# Altium schematic sheet PCB_DYBoard_Bandmaster_V2_SCH4.SchDoc
size A4; SheetNumber: 4; SheetTotal: 4
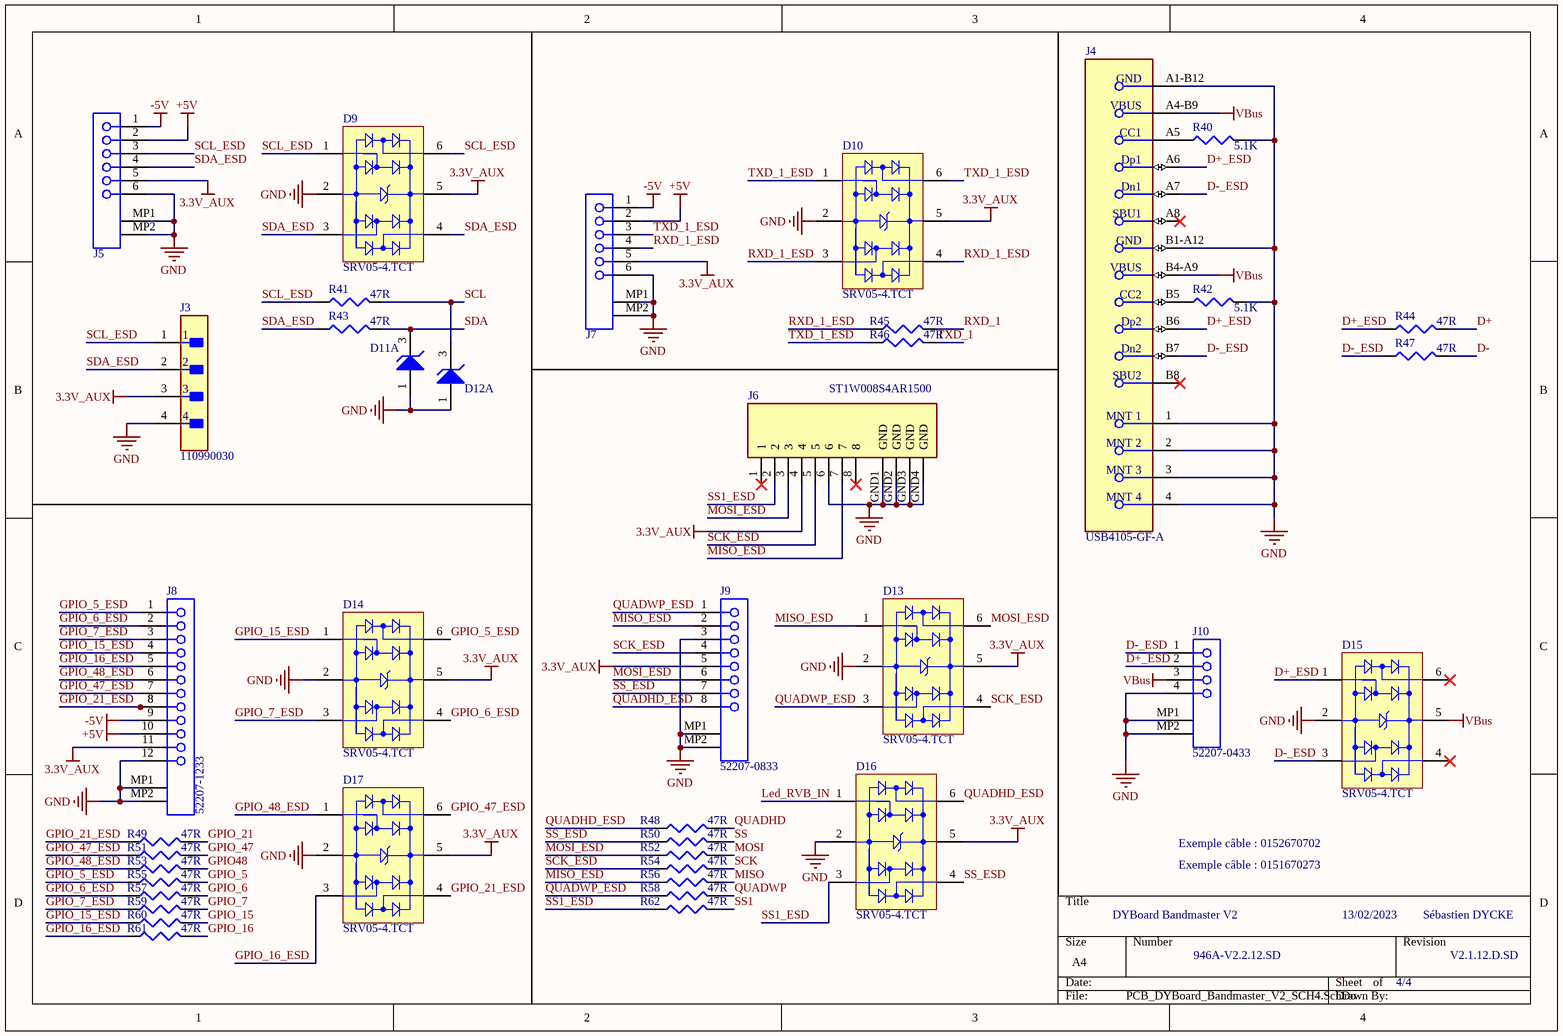
[diagram p0: PCB_DYBoard_Bandmaster_V2_SCH4.SchDoc]

## Parts
D9  SRV05-4.TCT  [SMTC-SOT23-6_V]
D10  SRV05-4.TCT  [SMTC-SOT23-6_V]
D11  BZX84C3V9LT1G  [ONSC-SOT-23-3-318-08_V]  (value not drawn)  (part A of 2)
D12  BZX84C3V9LT1G  [ONSC-SOT-23-3-318-08_V]  (value not drawn)  (part A of 2)
D13  SRV05-4.TCT  [SMTC-SOT23-6_V]
D14  SRV05-4.TCT  [SMTC-SOT23-6_V]
D15  SRV05-4.TCT  [SMTC-SOT23-6_V]
D16  SRV05-4.TCT  [SMTC-SOT23-6_V]
D17  SRV05-4.TCT  [SMTC-SOT23-6_V]
J3  110990030  [FP-110990030-MFG]
J4  USB4105-GF-A  [FP-USB4105-GF-A-MFG]
J5  SEB_MOLeX_6p  [SEB_MOLeX_6p]  (value not drawn)
J6  ST1W008S4AR1500  [JAE_ST1W008S4AR1500]
J7  SEB_MOLeX_6p  [SEB_MOLeX_6p]  (value not drawn)
J8  52207-1233  [52207-1233]
J9  52207-0833  [con_molex_8_52207-0833]
J10  52207-0433  [52207-0433]
R40  value 5.1K  [J1-0603]  (hidden comment: Res3)
R41  value 47R  [J1-0603]  (hidden comment: Res3)
R42  value 5.1K  [J1-0603]  (hidden comment: Res3)
R43  value 47R  [J1-0603]  (hidden comment: Res3)
R44  value 47R  [J1-0603]  (hidden comment: Res3)
R45  value 47R  [J1-0603]  (hidden comment: Res3)
R46  value 47R  [J1-0603]  (hidden comment: Res3)
R47  value 47R  [J1-0603]  (hidden comment: Res3)
R48  value 47R  [J1-0603]  (hidden comment: Res3)
R49  value 47R  [J1-0603]  (hidden comment: Res3)
R50  value 47R  [J1-0603]  (hidden comment: Res3)
R51  value 47R  [J1-0603]  (hidden comment: Res3)
R52  value 47R  [J1-0603]  (hidden comment: Res3)
R53  value 47R  [J1-0603]  (hidden comment: Res3)
R54  value 47R  [J1-0603]  (hidden comment: Res3)
R55  value 47R  [J1-0603]  (hidden comment: Res3)
R56  value 47R  [J1-0603]  (hidden comment: Res3)
R57  value 47R  [J1-0603]  (hidden comment: Res3)
R58  value 47R  [J1-0603]  (hidden comment: Res3)
R59  value 47R  [J1-0603]  (hidden comment: Res3)
R60  value 47R  [J1-0603]  (hidden comment: Res3)
R61  value 47R  [J1-0603]  (hidden comment: Res3)
R62  value 47R  [J1-0603]  (hidden comment: Res3)

## Nets
3.3V_AUX: D9.5(VBUS) D10.5(VBUS) D13.5(VBUS) D14.5(VBUS) D16.5(VBUS) D17.5(VBUS) J3.3 J5.5 J6.4 J7.5 J8.11 J9.5
+5V: J5.2 J7.2 J8.10
-5V: J5.1 J7.1 J8.9
GND: D9.2(GND) D10.2(GND) D11.1(A) D12.1(A) D13.2(GND) D14.2(GND) D15.2(GND) D16.2(GND) D17.2(GND) J3.4 J4.1(MNT_1) J4.2(MNT_2) J4.3(MNT_3) J4.4(MNT_4) J4.A1-B12(GND) J4.B1-A12(GND) J5.6 J5.MP1 J5.MP2 J6.6 J6.GND1(GND) J6.GND2(GND) J6.GND3(GND) J6.GND4(GND) J7.6 J7.MP1 J7.MP2 J8.12 J8.MP1 J8.MP2 J9.3 J9.MP1 J9.MP2 J10.4 J10.MP1 J10.MP2 R40.2 R42.2
VBus: D15.5(VBUS) J4.A4-B9(VBUS) J4.B4-A9(VBUS) J10.3
D+: R44.2
D+_ESD: D15.1(I/O_1) J4.A6(Dp1) J4.B6(Dp2) J10.2 R44.1
D-: R47.2
D-_ESD: D15.3(I/O_2) J4.A7(Dn1) J4.B7(Dn2) J10.1 R47.1
GPIO48: R53.2
GPIO_5: R55.2
GPIO_5_ESD: D14.6(I/O_4) J8.1 R55.1
GPIO_6: R57.2
GPIO_6_ESD: D14.4(I/O_3) J8.2 R57.1
GPIO_7: R59.2
GPIO_7_ESD: D14.3(I/O_2) J8.3 R59.1
GPIO_15: R60.2
GPIO_15_ESD: D14.1(I/O_1) J8.4 R60.1
GPIO_16: R61.2
GPIO_16_ESD: D17.3(I/O_2) J8.5 R61.1
GPIO_21: R49.2
GPIO_21_ESD: D17.4(I/O_3) J8.8 R49.1
GPIO_47: R51.2
GPIO_47_ESD: D17.6(I/O_4) J8.7 R51.1
GPIO_48_ESD: D17.1(I/O_1) J8.6 R53.1
Led_RVB_IN: D16.1(I/O_1)
MISO: R56.2
MISO_ESD: D13.1(I/O_1) J6.7 J9.2 R56.1
MOSI: R52.2
MOSI_ESD: D13.6(I/O_4) J6.3 J9.6 R52.1
QUADHD: R48.2
QUADHD_ESD: D16.6(I/O_4) J9.8 R48.1
QUADWP: R58.2
QUADWP_ESD: D13.3(I/O_2) J9.1 R58.1
RXD_1: R45.2
RXD_1_ESD: D10.3(I/O_2) D10.4(I/O_3) J7.4 R45.1
SCK: R54.2
SCK_ESD: D13.4(I/O_3) J6.5 J9.4 R54.1
SCL: D12.3(K) R41.2
SCL_ESD: D9.1(I/O_1) D9.6(I/O_4) J3.1 J5.3 R41.1
SDA: D11.3(K) R43.2
SDA_ESD: D9.3(I/O_2) D9.4(I/O_3) J3.2 J5.4 R43.1
SS: R50.2
SS1: R62.2
SS1_ESD: D16.3(I/O_2) J6.2 R62.1
SS_ESD: D16.4(I/O_3) J9.7 R50.1
TXD_1: R46.2
TXD_1_ESD: D10.1(I/O_1) D10.6(I/O_4) J7.3 R46.1
NetJ4_A5: J4.A5(CC1) R40.1
NetJ4_B5: J4.B5(CC2) R42.1

Not connected (* = marked no-connect by the designer): D15 4(I/O_3)* 6(I/O_4)*; J4 A8(SBU1)* B8(SBU2)*; J6 1* 8*

## Notes on the sheet
- Exemple câble : 0152670702
- DYBoard Bandmaster V2
- Exemple câble : 0151670273
- 13/02/2023
- Sébastien DYCKE
- 946A-V2.2.12.SD
- 4/4
- V2.1.12.D.SD

## Library data of the parts
D9 D10 D13-D17 = CMP-2000-05358-1: RailClamp(R) Low Capacitance TVS Diode Array, 5 pF, 17.5 VC, -55 to 125 degC, 6-Pin SOT23, RoHS, Tape and Reel; Manufacturer: Semtech; Leakage Current (Max): 5uA; Polarity: Uni-Directional; Peak Pulse Power Dissipation: 300W; Clamping Voltage: 17.5V; Number of Elements: 1; Working Voltage: 5V; Test Current (It): 1mA; Configuration: Quad; Reverse Breakdown Voltage: 6V; Suppressor Type: DiodeArrays; Peak Pulse Current: 12A; Product Depth (mm): 1.6mm; Product Height (mm): 1.15mm; Clamping Voltage (Max): 12.5V; Rad Hardened: No; Product Length (mm): 2.9mm; Capacitance Value: 5pF; Mounting: SurfaceMount; Datasheet URL: https://datasheet.ciiva.com/8029/srv05-4-8029973.pdf; Datasheet Version: Jan-08; Packaging: TapeandReel; Package / Case: SOT-23; Operating Temp Range: -55Cto125C; Pin Count: 6; Direction Type: Uni-Directional; Operating Temperature Min Deg. C: -55C; Reverse Stand-off Voltage: 5V; Leakage Current: 5uA; Manufacturer URL: http://www.semtech.com/; Working Voltage (Max): 5V; Package Reference: SOT23-6; Package Description: 6-Pin Small Outline Transistor, Body 2.9 x 1.6 mm, Pitch 0.95 mm; Operating Temperature Max Deg. C: 125C; Operating Temperature Classification: Military; Mounting Style: SurfaceMount
D11 D12 = CMP-1060-01129-1: Zener Voltage Regulator, 225 mW, 3-Pin SOT-23, Pb-Free, Tape and Reel; Manufacturer: On Semiconductor; ComponentLink3URL: http://www.onsemi.cn/pub_link/Collateral/318-08.PDF; PartNumber: BZX84C3V9LT1G; ComponentLink2URL: http://www.onsemi.com/pub_link/Collateral/BZX84C2V4LT1-D.PDF; PackageReference: SOT-23-3-318-08; DatasheetVersion: Rev. 17; ComponentLink3Description: Package Specification; ComponentLink1Description: Manufacturer URL; Packing: Tape and Reel; ComponentLink1URL: http://www.onsemi.com/; RoHS: Pb-Free; PackageVersion: Rev. AP, 11/2009; Mounting Technology: Surface Mount; PackageDescription: 3-Pin Small Outline Transistor, Body 2.92 x 1.3 mm, Pitch 0.95 mm; ComponentLink2Description: Datasheet
J3 = CMP-139044-000001-1: GROVE 2MM 4PIN VERT CONN 10PCS; Series: -
J4 = CMP-245163-000001-1: CONN RCPT USB2.0 TYPEC 5A; Manufacturer: GCT; Voltage Rating: 20V; Is Female: yes; Current Rating: 5/6.25/1.25/0.25A; Number Of Contacts: 16; Conn Orientation: Right Angle; Device Class L1: Connectors; Category: Conn; Lead Free: Yes; RoHS: TRUE; Temperature Range High: +85°C; Digikey Description: CONN RCPT USB2.0 TYPEC 5A; Device Class L3: unset; ComponentLink2Description: Datasheet; Manufacturer Part Number: USB4105-GF-A; Package: 0; Usb Standard: USB 2.0; Device Class L2: USB Connectors; Automotive: No; Temperature Range Low: -40°C; Height: 3.46mm; Temperature: -40°C to +85°C; Contact Material: Gold,Nickel; ComponentLink2URL: https://gct.co/files/drawings/usb4105.pdf; Octopart: https://octopart.com/usb4105-gf-a-gct-106627878
J6 = ST1W008S4AR1500: 8 Position Card Connector Secure Digital - microSDâ„¢ Surface Mount, Right Angle Gold; MF: JAE Electronics; SnapEDA_Link: https://www.snapeda.com/parts/ST1W008S4AR1500/JAE%20Electronics/view-part/423641/?ref=snap; Price: None; MP: ST1W008S4AR1500; Value: *; Availability: Warning; Purchase-URL: https://pricing.snapeda.com/search/part/ST1W008S4AR1500/?ref=eda; Package: None; Check_prices: https://www.snapeda.com/parts/ST1W008S4AR1500/JAE%20Electronics/view-part/423641/?ref=eda
R40-R62 = Res3: Resistor; Published: 8-Jun-2000; LatestRevisionDate: 29-May-2009; LatestRevisionNote: IPC-7351 Footprint Added.; PackageReference: J1-0603; Publisher: Altium Limited; PackageDescription: Chip Resistor